# Altium schematic sheet Ethernet.SchDoc
size A3
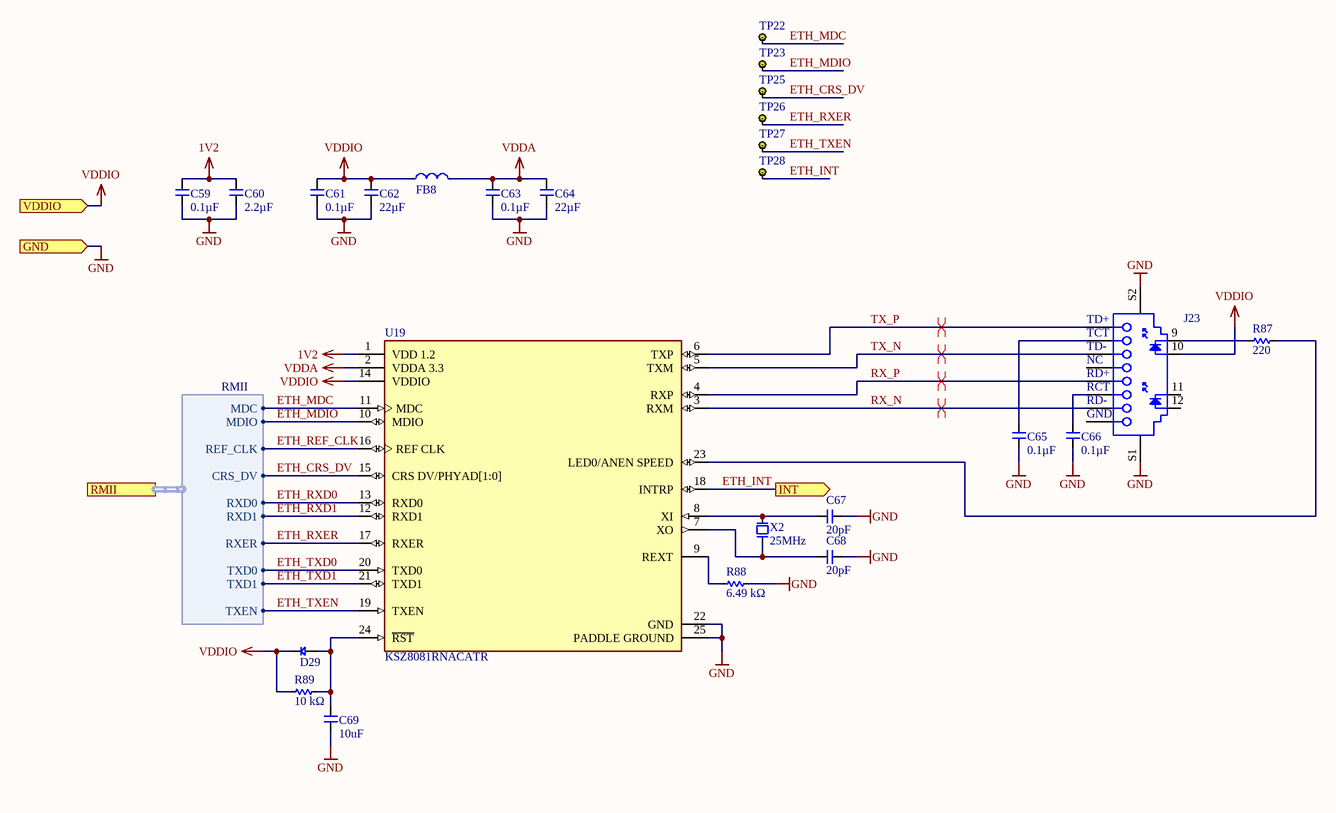
[diagram p0: Ethernet.SchDoc]

## Parts
C59  Capacitance (shorthand): 0.1µF  [C0603]  (hidden comment: 490-1519-1-ND)
C60  Capacitance (shorthand): 2.2µF  [C0603]  (hidden comment: 490-10731-1-ND)
C61  Capacitance (shorthand): 0.1µF  [C0603]  (hidden comment: 490-1519-1-ND)
C62  Capacitance (shorthand): 22µF  [C0603]  (hidden comment: 1276-7076-1-ND)
C63  Capacitance (shorthand): 0.1µF  [C0603]  (hidden comment: 490-1519-1-ND)
C64  Capacitance (shorthand): 22µF  [C0603]  (hidden comment: 1276-7076-1-ND)
C65  Capacitance (shorthand): 0.1µF  [C0603]  (hidden comment: 490-1519-1-ND)
C66  Capacitance (shorthand): 0.1µF  [C0603]  (hidden comment: 490-1519-1-ND)
C67  Capacitance (shorthand): 20pF  [C0603]  (hidden comment: 490-1410-1-ND)
C68  Capacitance (shorthand): 20pF  [C0603]  (hidden comment: 490-1410-1-ND)
C69  Capacitance: 10uF  [C0603]  (hidden comment: CAP_CER_10UF_6.3V_20%_X5R_SMD)
D29  DIODE_1N4148WT  [SOD523]  (value not drawn)
FB8  FB_120@100MHz_0603  [C0603]  (value not drawn)
J23  SI-50170-F  [BELS-SI-50170-F_V]  (value not drawn)
R87  Resistance (Sortable): 220  [R0603]  (hidden comment: 311-220HRCT-ND)
R88  Resistance: 6.49 kΩ  [R0603]  (hidden comment: 311-6.49KHRCT-ND)
R89  Resistance: 10 kΩ  [R0603]  (hidden comment: 311-10.0KHRCT-ND)
TP22  TEST_POINT_BLACK_KEYSTONE_5001  [TEST_POINT_BLACK_KEYSTONE_5001-Footprint-1]  (value not drawn)
TP23  TEST_POINT_BLACK_KEYSTONE_5001  [TEST_POINT_BLACK_KEYSTONE_5001-Footprint-1]  (value not drawn)
TP25  TEST_POINT_BLACK_KEYSTONE_5001  [TEST_POINT_BLACK_KEYSTONE_5001-Footprint-1]  (value not drawn)
TP26  TEST_POINT_BLACK_KEYSTONE_5001  [TEST_POINT_BLACK_KEYSTONE_5001-Footprint-1]  (value not drawn)
TP27  TEST_POINT_BLACK_KEYSTONE_5001  [TEST_POINT_BLACK_KEYSTONE_5001-Footprint-1]  (value not drawn)
TP28  TEST_POINT_BLACK_KEYSTONE_5001  [TEST_POINT_BLACK_KEYSTONE_5001-Footprint-1]  (value not drawn)
U19  KSZ8081RNACATR  [FP-QFN44-24LD-PL-1-IPC_B]
X2  Frequency: 25MHz  [4_SMD_3.2X2.5MM]  (hidden comment: XTAL_ XC1817CT-ND)

## Ports
GND (in), INT (out), RMII (harness RMII), VDDIO (in)

## Harnesses
RMII: MDC, MDIO, REF_CLK, CRS_DV, RXD0, RXD1, RXER, TXD0, TXD1, TXEN

## Nets
1V2: C59.1 C60.1 U19.1(VDD_1.2)
GND: C59.2 C60.2 C61.2 C62.2 C63.2 C64.2 C65.2 C66.2 C67.2 C68.2 C69.1 J23.S1 J23.S2 R88.1 U19.22(GND) U19.25(PADDLE_GROUND) ; port GND
VDDA: C63.1 C64.1 FB8.2 U19.2(VDDA_3.3)
VDDIO: C61.1 C62.1 D29.2 FB8.1 J23.10 R89.1 U19.14(VDDIO) ; port VDDIO
ETH_CRS_DV: TP25.1 U19.15(CRS_DV/PHYAD[1:0]) ; port RMII.CRS_DV
ETH_INT: TP28.1 U19.18(INTRP) ; port INT
ETH_MDC: TP22.1 U19.11(MDC) ; port RMII.MDC
ETH_MDIO: TP23.1 U19.10(MDIO) ; port RMII.MDIO
ETH_REF_CLK: U19.16(REF_CLK) ; port RMII.REF_CLK
ETH_RXD0: U19.13(RXD0) ; port RMII.RXD0
ETH_RXD1: U19.12(RXD1) ; port RMII.RXD1
ETH_RXER: TP26.1 U19.17(RXER) ; port RMII.RXER
ETH_TXD0: U19.20(TXD0) ; port RMII.TXD0
ETH_TXD1: U19.21(TXD1) ; port RMII.TXD1
ETH_TXEN: TP27.1 U19.19(TXEN) ; port RMII.TXEN
RX_N: J23.7(RD-) U19.3(RXM)
RX_P: J23.5(RD+) U19.4(RXP)
TX_N: J23.3(TD-) U19.5(TXM)
TX_P: J23.1(TD+) U19.6(TXP)
NetC65_1: C65.1 J23.2(TCT)
NetC66_1: C66.1 J23.6(RCT)
NetC67_1: C67.1 U19.8(XI) X2.3
NetC68_1: C68.1 U19.7(XO) X2.1
NetC69_2: C69.2 D29.1 R89.2 U19.24(~{RST})
NetJ23_9: J23.9 R87.1
NetR87_2: R87.2 U19.23(LED0/ANEN_SPEED)
NetR88_2: R88.2 U19.9(REXT)

Not connected (* = marked no-connect by the designer): J23 4(NC) 8(GND) 11 12

## Layout directives
differential pair: RX_N, RX_P, TX_N, TX_P

## Library data of the parts
C59 C61 C63 C65 C66 = CMP-119-0065-1: CAP CER 0603 0.1µF X7R 50V 10%; Manufacturer: Murata Electronics North America; Capacitance - pF (Machine readable): #NAME?; Dielectric: X7R; Rated Voltage: 50V
C60 = CMP-119-0069-1: CAP CER 2.2UF 16V X5R 0603 10%; Manufacturer: Murata Electronics North America; Capacitance - pF (Machine readable): #NAME?; Rated Voltage: 25V; Dielectric: X5R
C62 C64 = CMP-119-0072-1: CAP CER 22UF 16V X5R 0603 20%; Manufacturer: Samsung Electro-Mechanics; Capacitance - pF (Machine readable): #NAME?; Rated Voltage: 16V; Dielectric: X5R
C67 C68 = CMP-119-0007-1: CAP CER 20PF 50V C0G/NP0 0603; Manufacturer: Murata Electronics North America; Dielectric: C0G, NP0; Capacitance - pF (Machine readable): 20; Rated Voltage: 50V
C69 = CMP-027-0052-1: CAP CER 10UF 6.3V X5R 0603; Manufacturer Part Number: JMK107BJ106MA-T; Manufacturer: Taiyo Yuden; Tolerance: 20%; Height: 0.8mm; Min Operating Temperature: -55°C; Dielectric: X5R; ComponentLink2URL: https://www.verical.com/server-webapp/html/getDatasheet?partID=638457; ComponentLink4URL: http://www.onlinecomponents.com/productFiles/mf-TAI/1611jmk107abj106ma-t.pdf; Mount: Surface Mount; Stock 1: 4000; ComponentLink1URL: https://www.yuden.co.jp/productdata/catalog/mlcc_all_e.pdf; Lead Free: Lead Free; ComponentLink2Description: https://www.verical.com/server-webapp/html/getDatasheet?partID=638457; Case Code (Metric): 1608; Design Item ID: CAP_CER_10UF_6.3V_20%_X5R_SMD; Number of Pins: 2; REACH SVHC: Unknown; Radiation Hardening: No; Case/Package: 0603; Termination: SMD/SMT; Pricing 1: 1=0.18, 10=0.126, 100=0.0594, 500=0.04168, 1000=0.0345 (USD); ComponentLink4Description: http://www.onlinecomponents.com/productFiles/mf-TAI/1611jmk107abj106ma-t.pdf; Voltage Rating (DC): 6.3V; Thickness: 0.035inch; Length: 1.6mm; Case Code (Imperial): 0603; Composition: Ceramic; ComponentLink3URL: http://www.farnell.com/datasheets/1497285.pdf; Width: 0.8mm; ComponentLink1Description: https://www.yuden.co.jp/productdata/catalog/mlcc_all_e.pdf; Depth: 0.8mm; ComponentLink3Description: http://www.farnell.com/datasheets/1497285.pdf; Max Operating Temperature: 85°C; Packaging: Tape and Reel; Package Quantity: 1; Source: capacitor.SchLib; Voltage Rating: 6.3V
D29 = CMP-033-0014-1: DIODE SW 75V 4NS SOD-523F; Manufacturer: Fairchild Semiconductor; Voltage - Forward (Vf) (Max) @ If: 1V @ 10mA; Capacitance @ Vr, F: 5pF @ 0V, 1MHz; Diode Type: Standard; Current - Reverse Leakage @ Vr: 5µA @ 75V; Current - Average Rectified (Io): 200mA; Speed: Small Signal =< 200mA (Io), Any Speed; Voltage - DC Reverse (Vr) (Max): 75V; ComponentLink1URL: http://www.fairchildsemi.com/ds/1N/1N914BWT.pdf; ComponentLink1Description: Datasheet; Pricing 1: 1=0.4, 10=0.26, 100=0.113, 250=0.07344, 500=0.05198, 1000=0.03673 (USD); Reverse Recovery Time (trr): 4ns; Source: diode.SchLib; Packaging: Cut Tape (CT); Supplier Device Package: SOD-523F; Stock 1: 71864; Mounting Type: Surface Mount; Manufacturer Part Number: 1N4148WT; Package / Case: SC-79, SOD-523F; Design Item ID: DIODE_1N4148WT; RoHS: RoHS Compliant
FB8 = CMP-051-0015-1: FERRITE BEAD 120 OHM @ 100 MHz; Manufacturer: Taiyo Yuden; Manufacturer Part Number: BKP1608HS121-T; Filter Type: Power Line; Number of Lines: 1; Current Rating (Max): 2.7A; DC Resistance (DCR) (Max): 35 mOhm; RoHS: RoHS Compliant; Stock 1: 47959; Pricing 1: 1=0.1, 10=0.059, 25=0.052, 50=0.0474, 100=0.0426, 250=0.0312, 500=0.0227, 1000=0.02223 (USD); Packaging: Cut Tape (CT); Part Status: Active; Ratings: -; Operating Temperature: -55°C ~ 85°C; Package / Case: 0603 (1608 Metric); Mounting Type: Surface Mount; Height (Max): 0.037" (0.95mm); Size / Dimension: 0.063" L x 0.031" W (1.60mm x 0.80mm); ComponentLink1URL: http://ds.yuden.co.jp/TYCOMPAS/ut/detail.do?productNo=BKP1608HS121-T&fileName=BKP1608HS121-T_SS&mode=specSheetDownload; ComponentLink1Description: http://ds.yuden.co.jp/TYCOMPAS/ut/detail.do?productNo=BKP1608HS121-T&fileName=BKP1608HS121-T_SS&mode=specSheetDownload; Impedance @ Frequency: 120 Ohm @ 100MHz; Design Item ID: FB_120@100MHz_0603; Source: inductor.SchLib
J23 = CMP-00015-1: CONN MAGJACK 1PORT 100 BASE-T; Connector Type: RJ45; Direction: Up; Pitch: 2.54mm; Number of Cores per Jack: 4; Shielding: Shielded; Number of Contacts: 8; Number of Positions Loaded: 7; Number of Ports: 1; Termination: Solder; Orientation: Right Angle; Length: 17.98mm; Number of Rows: 1; Depth: 25.4mm; Case/Package: Metal; Contact Plating: Gold; Mount: Through Hole; Packaging: Tray; Lead Free: Lead Free; Contact Material: Copper Alloy,Gold; Series: MagJack® ST SI-50000; Housing Material: Thermoplastic; Color: Green,Silver; Package Quantity: 50
R87 = CMP-126-0101-2: RES SMD 220 OHM 1% 1/10W 0603; Manufacturer Part Number: RC0603FR-07220RL; Manufacturer: Yageo; Resistance: 220 Ω; Power (Watts): 0.1W, 1/10W; Temperature Coefficient: ±100ppm/°C; Image: //media.digikey.com/Renders/Yageo%20Renders/0603-(1608-Metric).jpg; Operating Temperature: -55°C ~ 155°C; Datasheets: http://www.yageo.com/documents/recent/PYu-RC_Group_51_RoHS_L_9.pdf; Tolerance: ±1%
R88 = CMP-126-0255-2: RES SMD 6.49K OHM 1% 1/10W 0603; Manufacturer Part Number: RC0603FR-076K49L; Manufacturer: Yageo; Power (Watts): 0.1W, 1/10W; Resistance (Sortable): 6490; Temperature Coefficient: ±100ppm/°C; Tolerance: ±1%; Datasheets: http://www.yageo.com/documents/recent/PYu-RC_Group_51_RoHS_L_9.pdf; Operating Temperature: -55°C ~ 155°C; Image: //media.digikey.com/Renders/Yageo%20Renders/0603-(1608-Metric).jpg
R89 = CMP-126-0273-2: RES SMD 10K OHM 1% 1/10W 0603; Manufacturer Part Number: RC0603FR-0710KL; Manufacturer: Yageo; Power (Watts): 0.1W, 1/10W; Temperature Coefficient: ±100ppm/°C; Resistance (Sortable): 10000; Tolerance: ±1%; Operating Temperature: -55°C ~ 155°C; Datasheets: http://www.yageo.com/documents/recent/PYu-RC_Group_51_RoHS_L_9.pdf; Image: //media.digikey.com/Renders/Yageo%20Renders/0603-(1608-Metric).jpg
TP22 TP23 TP25-TP28 = CMP-055-0004-2: BLACK T/H TEST POINT; Manufacturer Part Number: 5001; Manufacturer: Keystone Electronics; Material - Body: Phosphor Bronze; Material - Insulation: Nylon 46, UL 94V-0; Plating: Silver; ComponentLink1Description: http://www.keyelco.com/product-pdf.cfm?p=1310; Source: mechanical.SchLib; Part Status: Active; Stock 1: 718799; RoHS: RoHS Compliant; Packaging: Bulk; Mounting Type: 0.040" (1.02mm) Hole Diameter; ComponentLink1URL: http://www.keyelco.com/product-pdf.cfm?p=1310; Pricing 1: 1=0.37, 10=0.316, 50=0.2298, 100=0.2209, 250=0.19832, 500=0.18932, 1000=0.1616, 2500=0.14424, 5000=0.13523 (USD); Size / Dimension: 0.100" Dia x 0.180" L (2.54mm x 4.57mm); Color: Black; Design Item ID: TEST_POINT_BLACK_KEYSTONE_5001
U19 = CMP-00009-1: Ethernet Controller, 100 Mbps, IEEE 802.3, 3.135 V, 3.465 V, QFN, 24 ;RoHS Compliant: Yes; Min Supply Voltage: 3.135V; Max Supply Voltage: 3.465V; Simplex/Duplex: Full Duplex; Operating Supply Voltage: 3.3V; Max Supply Current: 47mA; Number of Transceivers: 1; Length: 4mm; Number of Pins: 24; Package Quantity: 1000; REACH SVHC: Unknown; Radiation Hardening: No; Packaging: Tape and Reel; Case/Package: QFN; Lead Free: Lead Free; Max Operating Temperature: 70°C; Height: 0.83mm; Width: 4mm; Mount: Surface Mount; Min Operating Temperature: 0°C; Data Rate: 100Mbps; Number of Channels: 1; Supply Voltage-Nom: 3.3V; Series: -
X2 = CMP-066-0004-2: 25MHz ±10ppm Crystal 20pF 40 Ohm -20°C ~ 70°C Surface Mount 4-SMD, No Lead (DFN, LCC); Manufacturer Part Number: ECS-250-20-33-CKM-TR; Manufacturer: ECS Inc.; ESR (Equivalent Series Resistance): 40 Ohm; Operating Mode: Fundamental; Package / Case: 4-SMD, No Lead (DFN, LCC); Mounting Type: Surface Mount; Load Capacitance: 20pF; ComponentLink1URL: http://www.ecsxtal.com/store/pdf/ecx-32.pdf; Ratings: -; RoHS: RoHS Compliant; Packaging: Cut Tape (CT); Source: oscillator.SchLib; Operating Temperature: -20°C ~ 70°C; Size / Dimension: 0.126" L x 0.098" W (3.20mm x 2.50mm); Frequency Tolerance: ±10ppm; Design Item ID: XTAL_ XC1817CT-ND; Height: 0.031" (0.80mm); Stock 1: 5860; ComponentLink1Description: http://www.ecsxtal.com/store/pdf/ecx-32.pdf; Pricing 1: 1=1.04, 10=0.92, 50=0.8588, 100=0.76, 500=0.7182 (USD); Frequency Stability: ±10ppm